# EasyEDA Pro project ACDC.eprj

# Schematic Schematic1
Create Date: 2024-07-25; Page Name: P1; Project Name: ACDC; Schematic Name: Schematic1; Update Date: 2024-07-27; Company: 嘉立创EDA; Page Size: A4; Version: V1.0
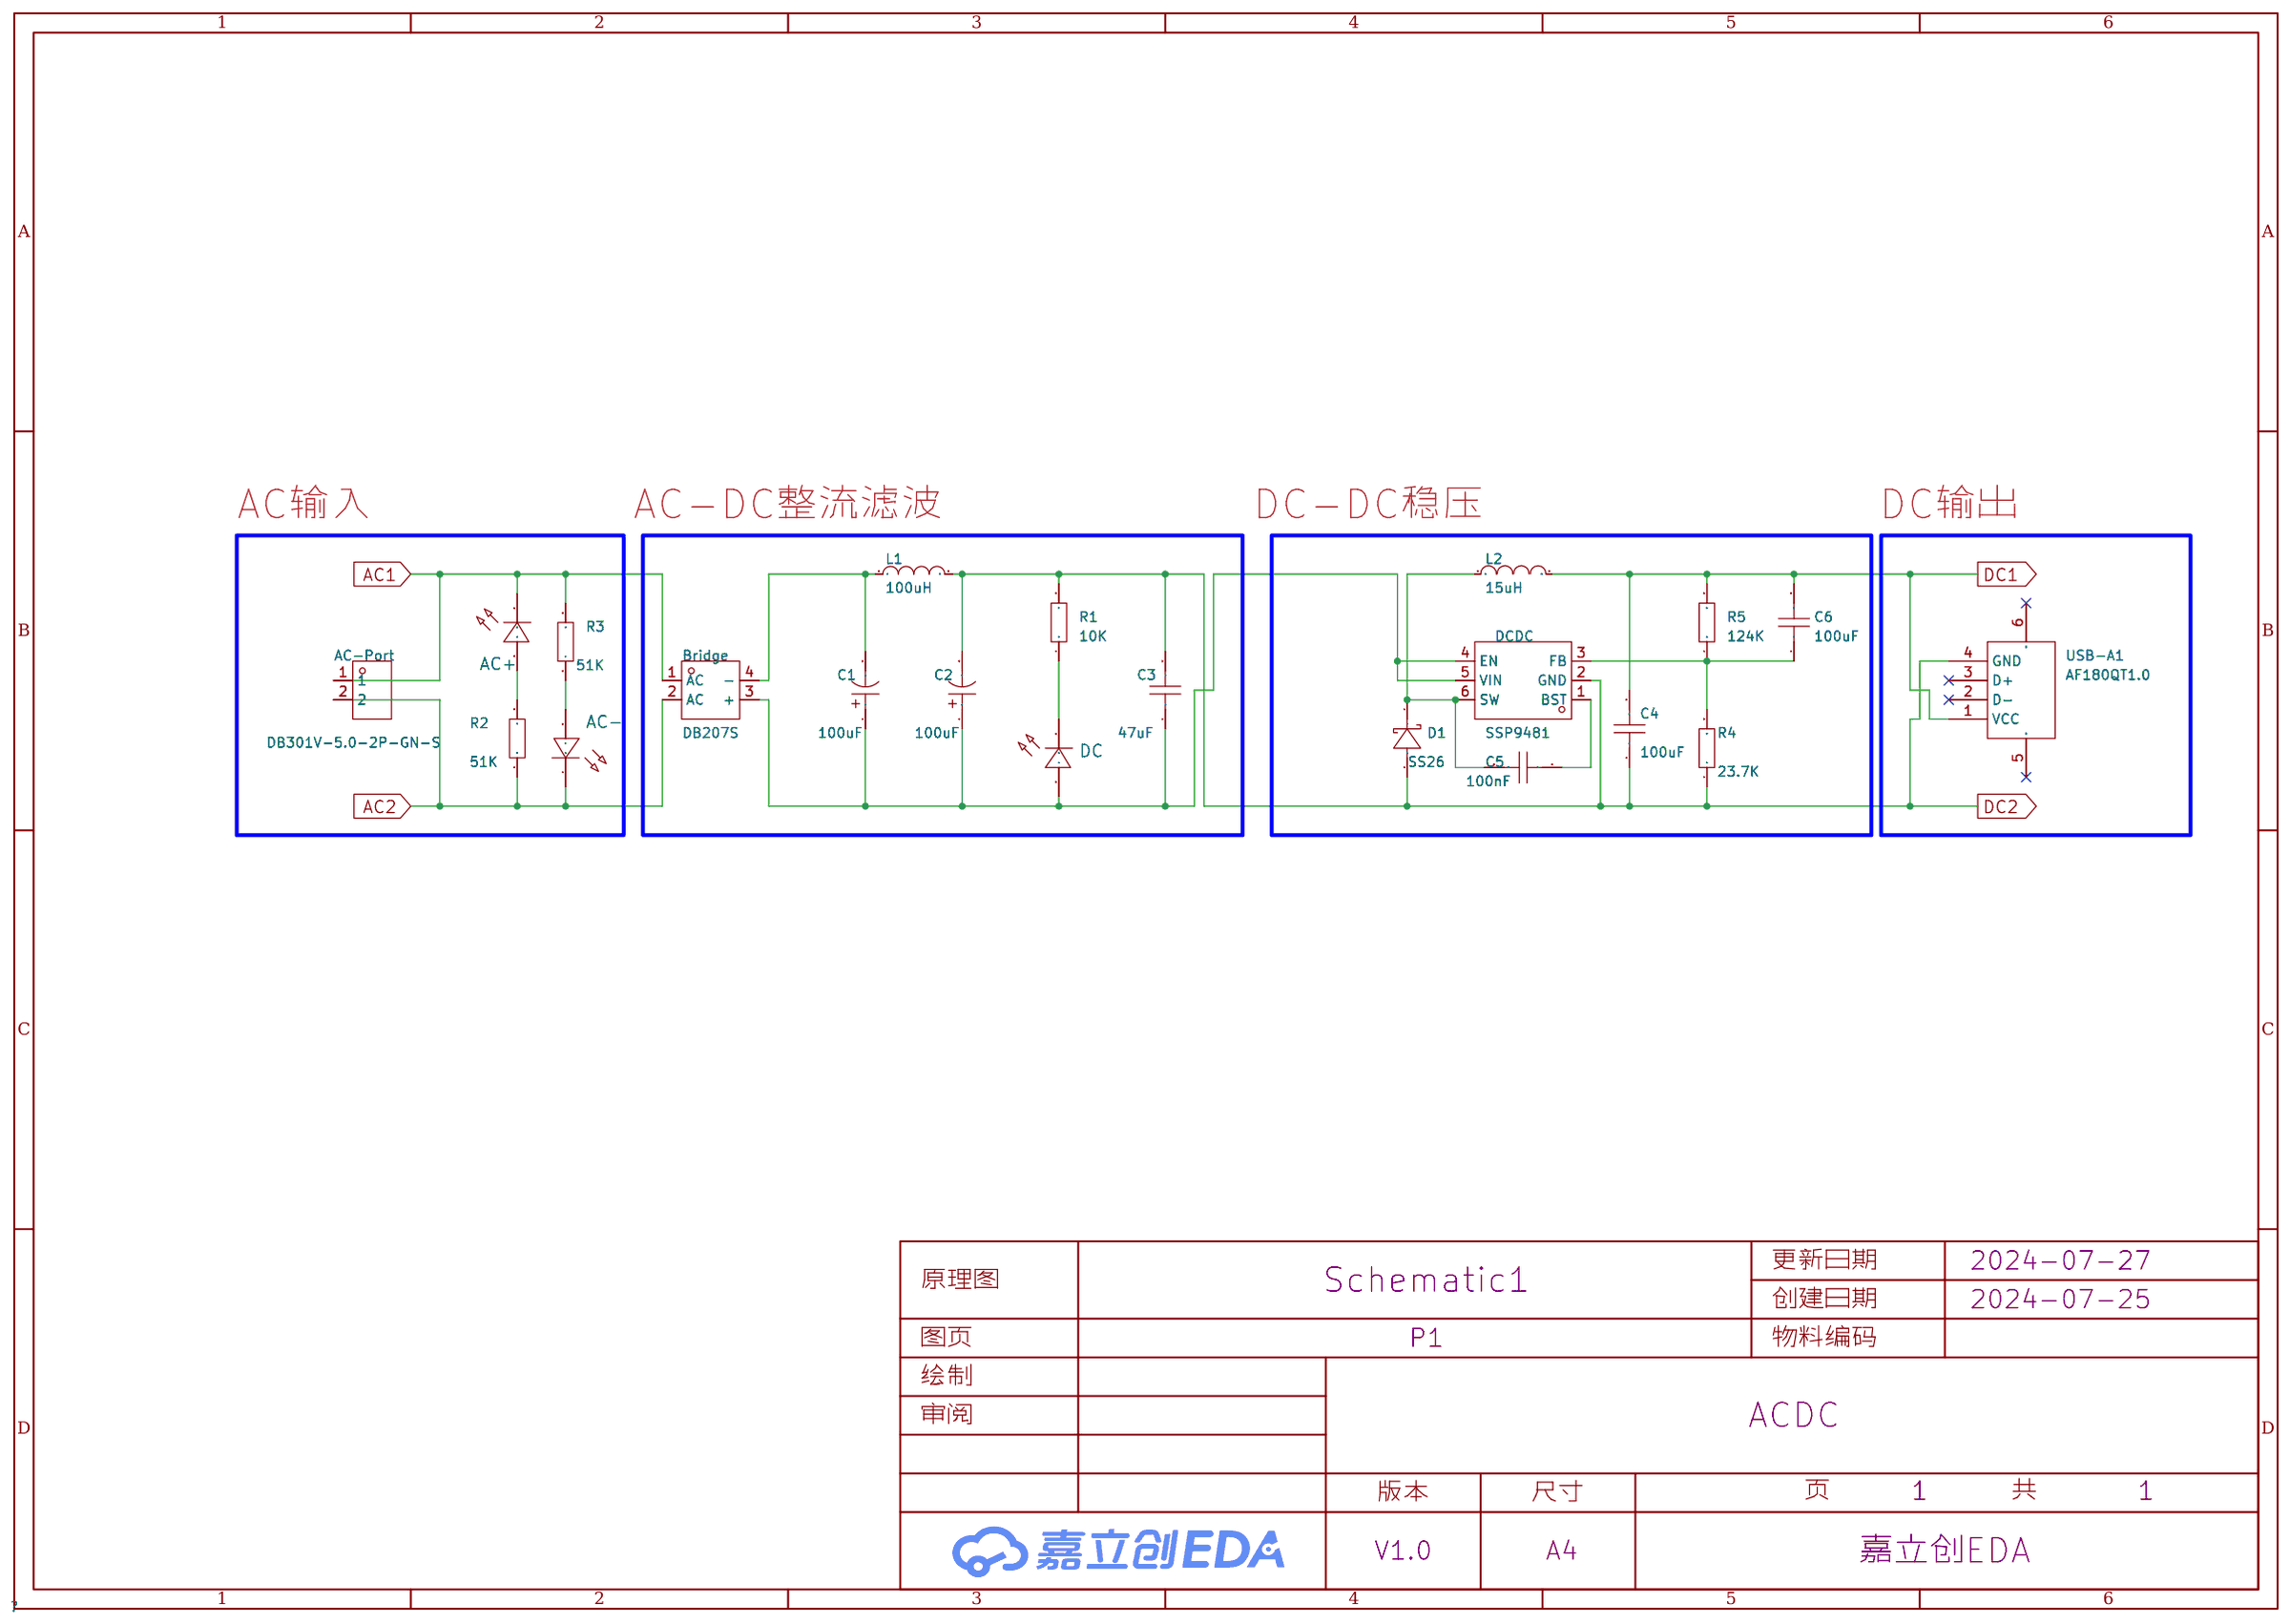
[diagram p0: schematic sheet]

## Parts
AC+  -  [LED_0603]
AC-  -  [LED_0603]
AC-Port  DB301V-5.0-2P-GN-S  [CONN-TH_2P-P5.00_DB301V-5.0-2P-GN-S]
Bridge  DB207S  [DBS_L8.4-W6.4-P5.10-LS10.2-TL]
C1  100uF  [CAP-TH_BD6.3-P2.50-D0.6-FD-1]
C2  100uF  [CAP-TH_BD6.3-P2.50-D0.6-FD-1]
C3  47uF  [C0603]
C4  100uF  [C0603]
C5  100nF  [C0603]
C6  100uF  [C0603]
D1  SS26  [SMA_L4.2-W2.6-LS5.3-RD]
DC  -  [LED_0603]
DCDC  SSP9481  [SOT-23-6_L2.9-W1.6-P0.95-LS2.8-BR]
L1  100uH  [IND-SMD_L11.6-W10.1]
L2  15uH  [L0603]
R1  10K  [R0603]
R2  51K  [R0603]
R3  51K  [R0603]
R4  23.7K  [R0603]
R5  124K  [R0603]
USB-A1  AF180QT1.0  [USB-A-SMD_AF180QT1.0]

## Library data of the parts
AC+ AC- DC = LED_0603-R: Supplier Footprint: 0603
AC-Port = DB301V-5.0-2P-GN-S: Supplier Part: C5155539; Manufacturer: DORABO(地博电气); Supplier Footprint: 插件,P=5mm; Datasheet: https://atta.szlcsc.com/upload/public/pdf/source/20230321/D511151DA9A574FE7610C3CBEF6C1AC3.pdf; Supplier: LCSC
Bridge = DB207S_C29174: 正向压降(Vf):1.1V@1A;直流反向耐压(Vr):1kV;整流电流:2A;正向浪涌电流(Ifsm):50A;; LCSC Part Name: 电压:1kV 电流:2A; Supplier Part: C29174; Manufacturer: MDD(辰达半导体); Supplier Footprint: DBS; Datasheet: https://atta.szlcsc.com/upload/public/pdf/source/20230823/E06957201793E2601024C0E48ACC7F59.pdf; Supplier: LCSC; Forward Voltage (Vf@If): 1.1V@1A; Reverse Voltage (Vr): 1kV; Rectified Current: 2A; Reverse Leakage Current (Ir): 10uA@1kV; Peak Forward Surge Current: 50A; Operating Temperature: -55℃~+150℃@(Tj)
C1 C2 = SPT1JM330E08ORVZC: 容值:33uF;精度:±20%;额定电压:63V;; LCSC Part Name: 33uF ±20% 63V; Supplier Part: C2896681; Manufacturer: Yunxing(云星); Supplier Footprint: 插件,D6.3xL8mm; Datasheet: https://atta.szlcsc.com/upload/public/pdf/source/20210917/C2896681_742F19F6F6FB06E33D6A5B083F41CED1.pdf; Supplier: LCSC; Tolerance: ±20%; Rated Voltage: 63V
C3-C6 = CAP_0603: Supplier Footprint: 0603
D1 = SS26_C2923952: 二极管配置:独立式;正向压降(Vf):700mV@2A;直流反向耐压(Vr):60V;平均整流电流(Io):2A;; LCSC Part Name: 电压:60V 电流:2A; Supplier Part: C2923952; Manufacturer: CJ(江苏长电/长晶); Supplier Footprint: SMAG; Datasheet: https://atta.szlcsc.com/upload/public/pdf/source/20211215/D3A84FE1ADED5816729B4A876C7DC644.pdf; Supplier: LCSC; Diode Configuration: 独立式; Forward Voltage (Vf@If): 700mV@2A; Reverse Voltage (Vr): 60V; Average Rectified Current (Io): 2A; Reverse Leakage Current (Ir): 500uA@60V
DCDC = SSP9481: 输入电压:4.5V~80V;输出电流(最大值):1A;; Supplier Part: C5444285; Manufacturer: Siproin(上海矽朋); Supplier Footprint: SOT23-6; Datasheet: https://atta.szlcsc.com/upload/public/pdf/source/20231012/2D8163DC6964B5C52867A7CB2611CD2C.pdf; Supplier: LCSC; Input Voltage: 4.5V~80V; Output Current (Max): 1A; Switching Frequency: 480kHz; Operating Temperature: -40℃~+125℃; Number of Outputs: 1; Topology: 降压式; Quiescent Current (Iq): 730uA; Switch tube (built-in/external): 内置
L1 = BCIHP1040SC-330M: 电感值:33uH;精度:±20%;额定电流:3.2A;饱和电流(Isat):5A;直流电阻(DCR):110mΩ;; LCSC Part Name: 33uH ±20% 5A; Supplier Part: C2921234; Manufacturer: BC(台湾诚阳); Supplier Footprint: SMD,10x11.6mm; Datasheet: https://atta.szlcsc.com/upload/public/pdf/source/20220607/A7B75DDA7DB669F05B3AF3F96D31C6AA.pdf; Supplier: LCSC; Tolerance: ±20%; Rated Current: 3.2A; Saturation Current (Isat): 5A; DC Resistance (DCR): 110mΩ
L2 = L_0603
R1-R5 = Res_0603: Supplier Footprint: 0603
USB-A1 = AF180QT1.0: 连接器类型:Type-A;标准:USB 2.0;公母:母;端口数量:1;触点数量:4P;安装方式:卧贴;额定电流 - 电源:-;工作温度范围:-;; LCSC Part Name: Type-A 母 卧贴; Supplier Part: C404963; Manufacturer: SHOU HAN(首韩); Supplier Footprint: SMD; Datasheet: https://atta.szlcsc.com/upload/public/pdf/source/20190722/C404963_FD7C48D0FD141784D3899E0BE1E5ED69.pdf; Supplier: LCSC; Connector Type: Type-A; Standard: USB 2.0; Gender: 母; Number of Ports: 1; Number of Contacts: 4P; Mounting Style: 卧贴

## Nets
AC1: AC+.1(C) AC-Port.1 Bridge.1(AC) R3.2
AC2: AC-.1(C) AC-Port.2 Bridge.2(AC) R2.1
DC1: C4.2 C6.2 L2.2 R5.2 USB-A1.1(VCC)
DC2: C2.2 C3.2 C4.1 D1.2(A) DCDC.2(GND) L1.2 R1.2 R4.1 USB-A1.4(GND)
$1N527: Bridge.4(-) C1.2 L1.1
$1N1222: DC.1(C) R1.1
$1N1400: AC+.2(A) R2.2
$1N1434: AC-.2(A) R3.1
Net-(Bridge-3): Bridge.3(+) C1.1 C2.1 C3.1 DC.2(A) DCDC.4(EN) DCDC.5(VIN)
Net-(C5-1): C5.1 DCDC.1(BST)
Net-(C5-2): C5.2 D1.1(K) DCDC.6(SW) L2.1
Net-(C6-1): C6.1 DCDC.3(FB) R4.2 R5.1

Not connected (* = marked no-connect by the designer): USB-A1 2(D-)* 3(D+)* 5(SH1)* 6(SH2)*

## Notes on the sheet
- AC输入
- AC-DC整流滤波
- DC-DC稳压
- DC输出

# Board PCB1
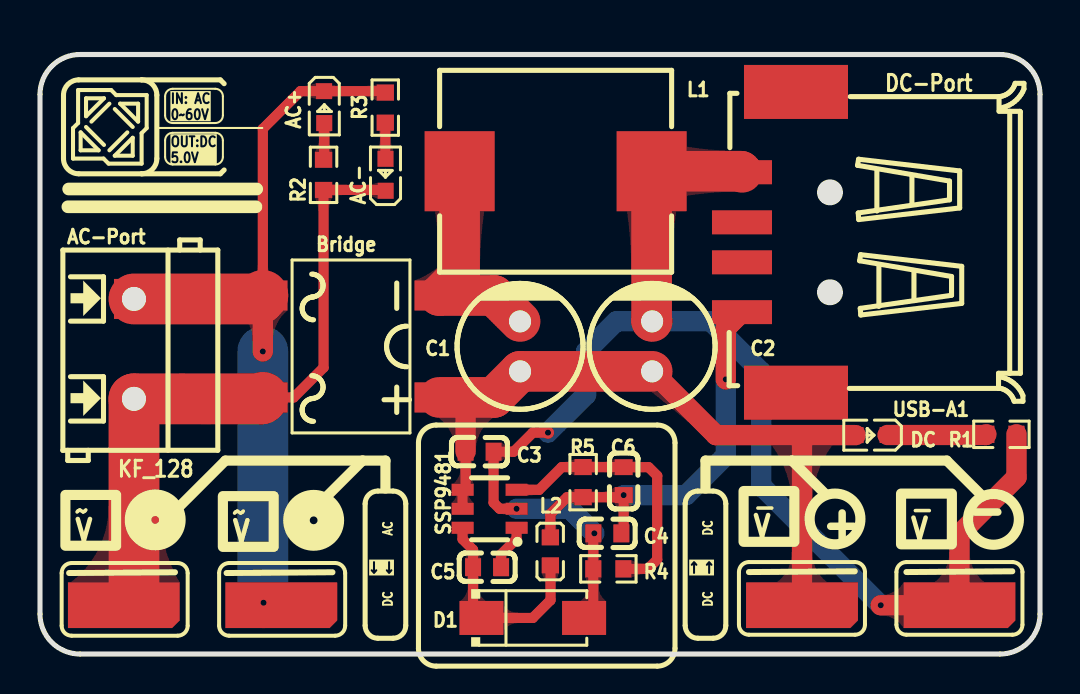
[diagram p1: board, top side]
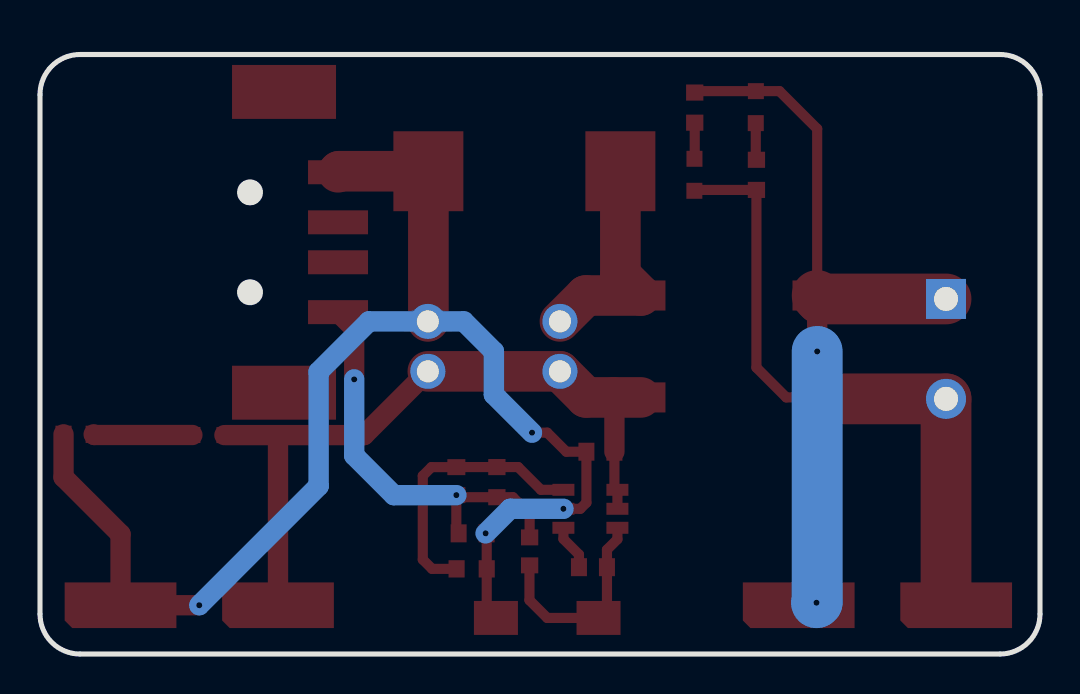
[diagram p2: board, bottom side, seen from below]

Outline 50 x 30 mm; copper layers: Top Layer, Bottom Layer. Coordinates in mm from the lower left corner of the outline.
Outline path: 0,28 0,2 arc(0.59,0.59) 2,0 48,0 arc(49.41,0.59) 50,2 50,28 arc(49.41,29.41) 48,30 2,30 arc(0.59,29.41) 0,28
Stack: Top Layer 0.035mm / Dielectric1 1.51mm FR4 er 4.5 / Bottom Layer 0.035mm

## Design rules (mm)
template: JLCPCB Capability(Two Layers Board)
spacing copperThickness1oz (default): track to track 0.102, other pairs 0.152 to 0.3
spacing copperThickness2oz: track to track 0.203, other pairs 0.152 to 0.3
track width copperThickness1oz (default): min 0.127, default 0.254, max 2.54
track width copperThickness2oz: min 0.203, default 0.254, max 2.54
differential pair differentialPair (default): width min 0.127, default 0.254, max 2.54; gap min 0.152, default 0.152
via viaSize (default): diameter min 0.5, default 0.61, max 10; hole min 0.3, default 0.305, max 6.3

## Placement (name value [footprint] x y rotation side)
AC+  -  [LED_0603]  14.22 27.31 270 top
AC-  -  [LED_0603]  17.27 24.03 90 top
AC-Port  DB301V-5.0-2P-GN-S  [CONN-TH_2P-P5.00_DB301V-5.0-2P-GN-S]  4.7 15.27 270 top
Bridge  DB207S  [DBS_L8.4-W6.4-P5.10-LS10.2-TL]  15.55 15.39 0 top
C1  100uF  [CAP-TH_BD6.3-P2.50-D0.6-FD-1]  24 15.39 90 top
C2  100uF  [CAP-TH_BD6.3-P2.50-D0.6-FD-1]  30.61 15.39 90 top
C3  47uF  [C0603]  21.98 10.12 0 top
C4  100uF  [C0603]  28.37 6.04 0 top
C5  100nF  [C0603]  22.35 4.35 180 top
C6  100uF  [C0603]  29.18 8.65 270 top
D1  SS26  [SMA_L4.2-W2.6-LS5.3-RD]  24.64 1.81 0 top
DC  -  [LED_0603]  41.53 10.95 180 top
L1  100uH  [IND-SMD_L11.6-W10.1]  25.78 24.16 0 top
L2  15uH  [L0603]  25.52 5.14 90 top
NOREF  -  [Pad_e220]  12.06 2.44 0 top
NOREF#2  -  [Pad_e221]  4.19 2.44 0 top
NOREF#3  -  [Pad_e218]  45.97 2.44 0 top
NOREF#4  -  [Pad_e217]  38.1 2.44 0 top
R1  10K  [R0603]  48.07 10.99 0 top
R2  51K  [R0603]  14.18 23.98 90 top
R3  51K  [R0603]  17.26 27.34 90 top
R4  23.7K  [R0603]  28.42 4.26 0 top
R5  124K  [R0603]  27.16 8.6 270 top
SSP9481  SSP9481  [SOT-23-6_L2.9-W1.6-P0.95-LS2.8-BR]  22.48 7.27 0 top
USB-A1  AF180QT1.0  [USB-A-SMD_AF180QT1.0]  36.45 20.6 90 top

## Footprints (pads in the part's own frame, mm; a bottom-side part is the same pattern mirrored in y, then rotated)
C0603
  rect 0.8x0.9 smd: 1(-0.7,0) 2(0.7,0)
CAP-TH_BD6.3-P2.50-D0.6-FD-1
  round 1.75 hole 1.1: 1(-1.25,0) 2(1.25,0)
CONN-TH_2P-P5.00_DB301V-5.0-2P-GN-S
  rect 2x2 hole 1.2: 1(-2.5,0)
  round 2 hole 1.2: 2(2.5,0)
DBS_L8.4-W6.4-P5.10-LS10.2-TL
  rect 2.47x1.505 smd: 1(-4.41,2.55) 2(-4.41,-2.55) 3(4.41,-2.55) 4(4.41,2.55)
IND-SMD_L11.6-W10.1
  rect 3.5x4 smd: 1(-4.8,0) 2(4.8,0)
L0603
  rect 0.8x0.864 smd: 1(-0.7,0) 2(0.7,0)
LED_0603
  rect 0.8x0.8 smd: 1(-0.851,-0.01) 2(0.75,-0.005)
Pad_e217
  custom 5.588x2.286 smd: DC2(0,0)
Pad_e218
  custom 5.588x2.286 smd: DC1(0,0)
Pad_e220
  custom 5.588x2.286 smd: AC1(0,0)
Pad_e221
  custom 5.588x2.286 smd: AC2(0,0)
R0603
  rect 0.806x0.864 smd: 1(-0.753,0) 2(0.753,0)
SMA_L4.2-W2.6-LS5.3-RD
  rect 2.2x1.7 smd: 1(-2.566,0) 2(2.566,0)
SOT-23-6_L2.9-W1.6-P0.95-LS2.8-BR
  rect 1.1x0.6 smd: 1(1.35,-0.95) 2(1.35,0) 3(1.35,0.95) 4(-1.35,0.95) 5(-1.35,0) 6(-1.35,-0.95)
USB-A-SMD_AF180QT1.0
  rect 1.2x3 smd: 1(-3.495,1.35) 2(-1,1.35) 3(1,1.35) 4(3.505,1.35)
  rect 2.7x5.2 smd: 5(7.525,-1.35) 6(-7.525,-1.35)

## Nets
AC1: AC+.1 AC-Port.1 Bridge.1 NOREF.AC1 R3.2
AC2: AC-.1 AC-Port.2 Bridge.2 NOREF#2.AC2 R2.1
DC1: C4.2 C6.2 L2.2 R5.2 USB-A1.1
DC2: C2.2 C3.2 C4.1 D1.2 L1.2 NOREF#3.DC1 R1.2 R4.1 SSP9481.2 USB-A1.4
$1N527: Bridge.4 C1.2 L1.1
$1N1222: DC.1 R1.1
$1N1400: AC+.2 R2.2
$1N1434: AC-.2 R3.1
$1N2369: C5.2 D1.1 L2.1 SSP9481.6
$1N2382: C5.1 SSP9481.1
$1N2758: Bridge.3 C1.1 C2.1 C3.1 DC.2 NOREF#4.DC2 SSP9481.4 SSP9481.5
$1N3169: C6.1 R4.2 R5.1 SSP9481.3

Pads without a net: USB-A1 2 3 5 6

## Via types
v1: diameter 0.61, hole 0.305, Top Layer to Bottom Layer, 8 vias

## Routing (per net, layer and track width the routed paths; a pad name or vN(x,y) marks a point on that pad's centre or on a via; arc(x,y) is an arc through that point)
AC1: length 37.2
  Top Layer w0.508: R3.2 17.19,28.17 AC+.1 13.03,28.17 11.14,26.28 Bridge.1
  Top Layer w1.016: Bridge.1 v1(11.14,15.14)
  Top Layer w2.54: AC-Port.1 10.97,17.77 Bridge.1
  Bottom Layer w2.54: v1(11.14,15.14) 11.14,2.6 v1(11.18,2.57)
AC2: length 32
  Top Layer w0.508: Bridge.2 12.69,12.84 14.18,14.33 R2.1 17.24,23.22 AC-.1
  Top Layer w2.54: Bridge.2 11.07,12.77 AC-Port.2 4.7,2.95
DC1: length 20.6
  Top Layer w0.508: C4.2 29.18,6.15 v1(29.18,7.95) 29.08,7.85 R5.2 26.35,7.85 25.52,7.01 L2.2
  Top Layer w1.016: v1(34.29,13.74) 34.29,16.3 USB-A1.1
  Bottom Layer w1.016: v1(34.29,13.74) 34.29,9.93 32.31,7.95 v1(29.18,7.95)
DC2: length 70.9
  Top Layer w0.508: v1(23.83,7.27) 22.99,7.27 22.68,7.57 C3.2 23.68,10.12 24.64,11.08 v1(25.4,11.08) ; C4.1 27.66,6.03 R4.1 27.66,2.27 D1.2
  Top Layer w1.016: R1.2 48.82,8.85 45.97,6 NOREF#3.DC1 v1(42.04,2.44)
  Top Layer w2.032: USB-A1.4 35.05,24.16 30.58,24.16 30.58,16.67 C2.2
  Bottom Layer w1.016: v1(25.4,11.08) 27.31,12.98 27.31,15.14 28.81,16.64 C2.2 33.55,16.64 36.07,14.12 36.07,8.41 v1(42.04,2.44) ; v1(23.83,7.27) 26.49,7.27 v1(27.72,6.04)
$1N527: length 11.2
  Top Layer w2.032: L1.1 20.98,18.96 Bridge.4 22.71,17.94 C1.2
$1N1222: length 5
  Top Layer w1.016: R1.1 47.28,10.96 DC.1
$1N1400: length 1.8
  Top Layer w0.508: AC+.2 14.21,24.76 14.18,24.73
$1N1434: length 1.8
  Top Layer w0.508: AC-.2 17.26,24.79 R3.1
$1N2369: length 10.5
  Top Layer w0.508: L2.1 25.53,4.43 25.53,2.69 24.64,1.81 D1.1 21.65,2.23 C5.2 21.65,5.22 21.13,5.74 21.13,6.32
$1N2382: length 2.3
  Top Layer w0.508: SSP9481.1 23.83,5.76 23.05,4.98 C5.1
$1N2758: length 36.8
  Top Layer w0.508: 21.13,7.27 21.13,8.22 21.28,8.37 C3.1
  Top Layer w1.016: NOREF#4.DC2 38.1,10.95 38.1,10.95 ; 38.1,10.95 33.8,10.95 C2.1 ; 38.1,10.95 DC.2 ; 21.32,12.84 21.28,12.8 C3.1
  Top Layer w2.032: Bridge.3 22.7,12.84 C1.1 C2.1
$1N3169: length 13.8
  Top Layer w0.508: R4.2 30.4,4.26 30.86,4.73 30.86,8.92 30.43,9.35 C6.1 29.18,9.35 R5.1 26.09,9.35 24.95,8.22 SSP9481.3

## Copper pours and planes (outline as drawn; the poured copper is in the pictures)
AC1 on Bottom Layer: -1.4,31.65 17.53,31.65 17.53,-1.75 -1.4,-1.75
DC2 on Top Layer: 18.69,31.02 52.83,31.02 52.83,-0.48 18.69,-0.48
DC2 on Bottom Layer: 19.43,32.16 57.78,32.16 57.78,-1.24 19.43,-1.24

Small or netless copper shapes (teardrops, artwork), in the pictures only: 59 on Top Layer, 2 on Bottom Layer

## Text on the board
Top Silkscreen Layer: AC | DC | IN: AC / 0~60V | OUT:DC / 5.0V | DC-Port | KF_128 | ~ | - | V | + | ↓↓ | ↑↑
